# Altium schematic sheet Schematic_Rauch.SchDoc
size A4
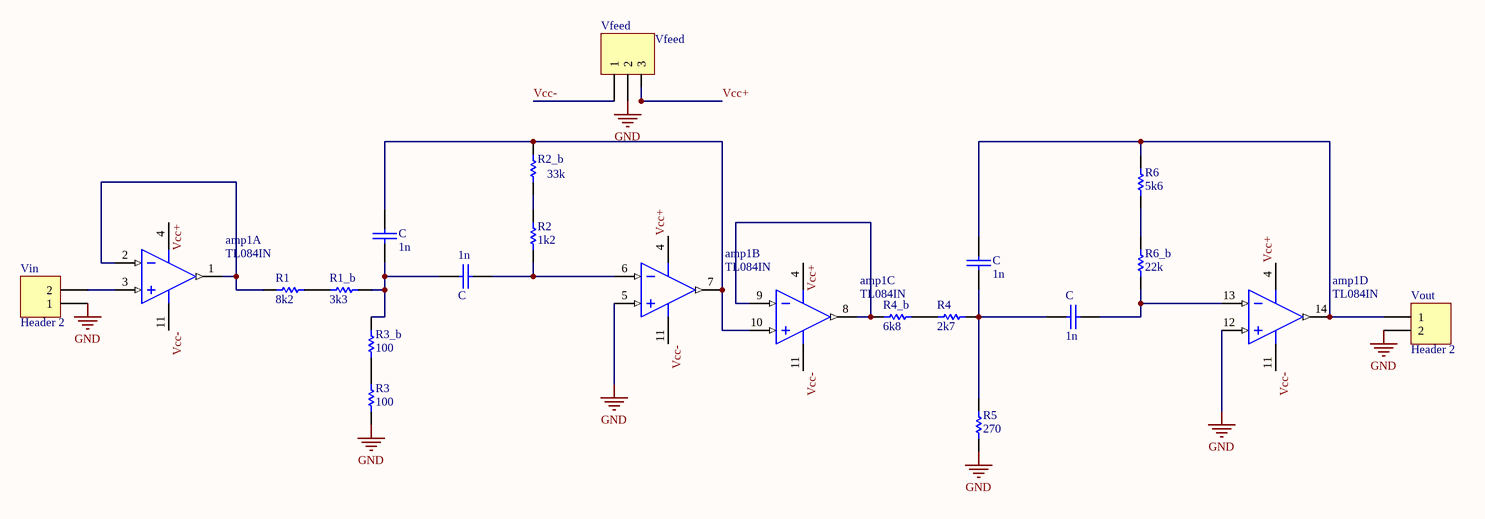
[diagram p0: Schematic_Rauch.SchDoc]

## Parts
(Parts that share a designator on the sheet are numbered #1, #2 ... from top to bottom, then left to right.)
1n  C  [CAP200]
amp1  TL084IN  [TI-N14]  (parts A,B,C,D of 4)
C#1  1n  [CAP200]
C#2  1n  [CAP200]
C#3  1n  [CAP200]
R1  8k2  [0805]
R1_b  3k3  [0805]
R2  1k2  [0805]
R2_b  33k  [0805]
R3  100  [0805]
R3_b  100  [0805]
R4  2k7  [0805]
R4_b  6k8  [0805]
R5  270  [0805]
R6  5k6  [0805]
R6_b  22k  [0805]
Vfeed  Vfeed  [HDR1X3]
Vin  Header 2  [HDR1X2]
Vout  Header 2  [HDR1X2]

## Nets
GND: amp1.5(IN2+) amp1.12(IN4+) R3.1 R5.1 Vfeed.2 Vin.1 Vout.2
Vcc+: amp1.4(VCC+) Vfeed.3
Vcc-: amp1.11(VCC-) Vfeed.1
Net1n_1: 1n.1 C#1.2 R1_b.2 R3_b.2
Net1n_2: 1n.2 amp1.6(IN2-) R2.1
Netamp1_1: amp1.1(OUT1) amp1.2(IN1-) R1.1
Netamp1_3: amp1.3(IN1+) Vin.2
Netamp1_7: amp1.7(OUT2) amp1.10(IN3+) C#1.1 R2_b.2
Netamp1_8: amp1.8(OUT3) amp1.9(IN3-) R4_b.1
Netamp1_13: amp1.13(IN4-) C#3.2 R6_b.1
Netamp1_14: amp1.14(OUT4) C#2.1 R6.2 Vout.1
NetC#2_2: C#2.2 C#3.1 R4.2 R5.2
NetR1_2: R1.2 R1_b.1
NetR2_2: R2.2 R2_b.1
NetR3_2: R3.2 R3_b.1
NetR4_1: R4.1 R4_b.2
NetR6_1: R6.1 R6_b.2

## Library data of the parts
1n C#1-C#3 = CAP
amp1 = TL084IN: JFET-Input Operational Amplifier, 7 to 36 V, -40 to 85 degC, 14-pin DIP (N14), Pb-Free (RoHS); Manufacturer: Texas Instruments; CMRR(Min)(dB): 75; GBW(Typ)(MHz): 3; IIB(Max)(pA): 200; Iq per channel(Max)(mA): 2.8; Number of Channels: 4; Offset Drift(Typ)(uV/C): 18; Rating: Catalog; Slew Rate(Typ)(V/us): 13; Sub Family: General Purpose Amplifier, High Supply Voltage Amplifier (>=30V); Total Supply Voltage(Max)(+5V is 5, +/-5V is 10): 36; Total Supply Voltage(Min)(+5V is 5, +/-5V is 10): 7; Vio (25C)(Max)(mV): 6; DatasheetVersion: SLOS081G; PackageVersion: 4040049/E, 12/2002; PackageReference: N14; PackageDescription: 14-Pin Plastic In-Line, Body 19.305 x 6.35 mm, Pitch 2.54 mm; Supplier 1: Digi-Key; Supplier Part Number 1: 296-7213-5-ND; Supplier 2: Farnell; Supplier Part Number 2: 1387834; Supplier 3: Newark; Supplier Part Number 3: 60K6994; Supplier 4: Mouser; Supplier Part Number 4: 595-TL084IN; Eco-Plan: Pb-Free (RoHS); Vn at 1kHz(Typ)(nV/rtHz): 18; Mounting Technology: Through Hole; Code_JEDEC: MS-001; PartNumber: TL084IN; ComponentLink1Description: Manufacturer URL; ComponentLink1URL: http://www.ti.com/; ComponentLink2Description: Datasheet; ComponentLink2URL: http://www.ti.com/lit/ds/symlink/tl084.pdf; ComponentLink3Description: Package Specification; ComponentLink3URL: http://www.ti.com/lit/ml/mpdi002c/mpdi002c.pdf
R1 R1_b R2 R2_b R3 R3_b R4 R4_b R5 R6 R6_b = RES
Vfeed = Header 3: Header, 3-Pin; LatestRevisionDate: 17-Jul-2002; LatestRevisionNote: Re-released for DXP Platform.; Publisher: Altium Limited
Vin Vout = Header 2: Header, 2-Pin; LatestRevisionDate: 17-Jul-2002; LatestRevisionNote: Re-released for DXP Platform.; Publisher: Altium Limited